# Altium project DriverControls.PrjPcb
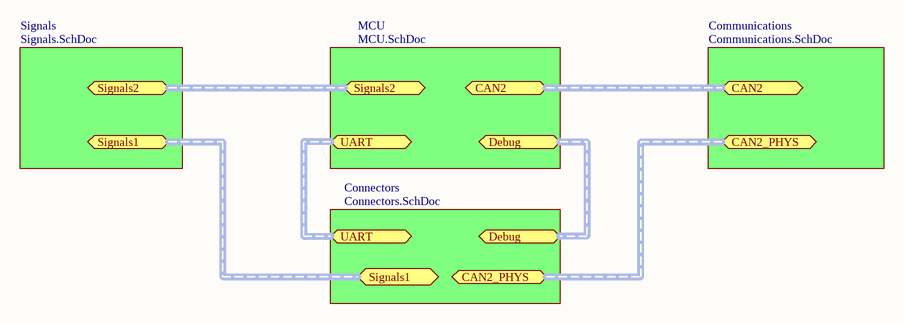
[diagram p0: Main.SchDoc]
7 sheets, 143 parts. Net scope: flat (ports and power ports of the same name join across sheets).
Board file: DriverControlsPCB.PcbDoc
Sheets:
  Main.SchDoc
    Connectors = Connectors.SchDoc
    MCU = MCU.SchDoc
    Communications = Communications.SchDoc
    Signals = Signals.SchDoc
  Connectors2.SchDoc
  Power.SchDoc

## Sheet Main.SchDoc
size A4

### Sub-sheets
Communications = Communications.SchDoc: no entries
Connectors = Connectors.SchDoc: no entries
MCU = MCU.SchDoc: no entries
Signals = Signals.SchDoc: no entries

### Ports
CAN2 (harness CAN), CAN2_PHYS (harness CAN_PHYS), Debug (harness Debug), Signals1 (harness Signals), Signals2 (harness Signals), UART (harness UART)

## Sheet Connectors.SchDoc
size A4
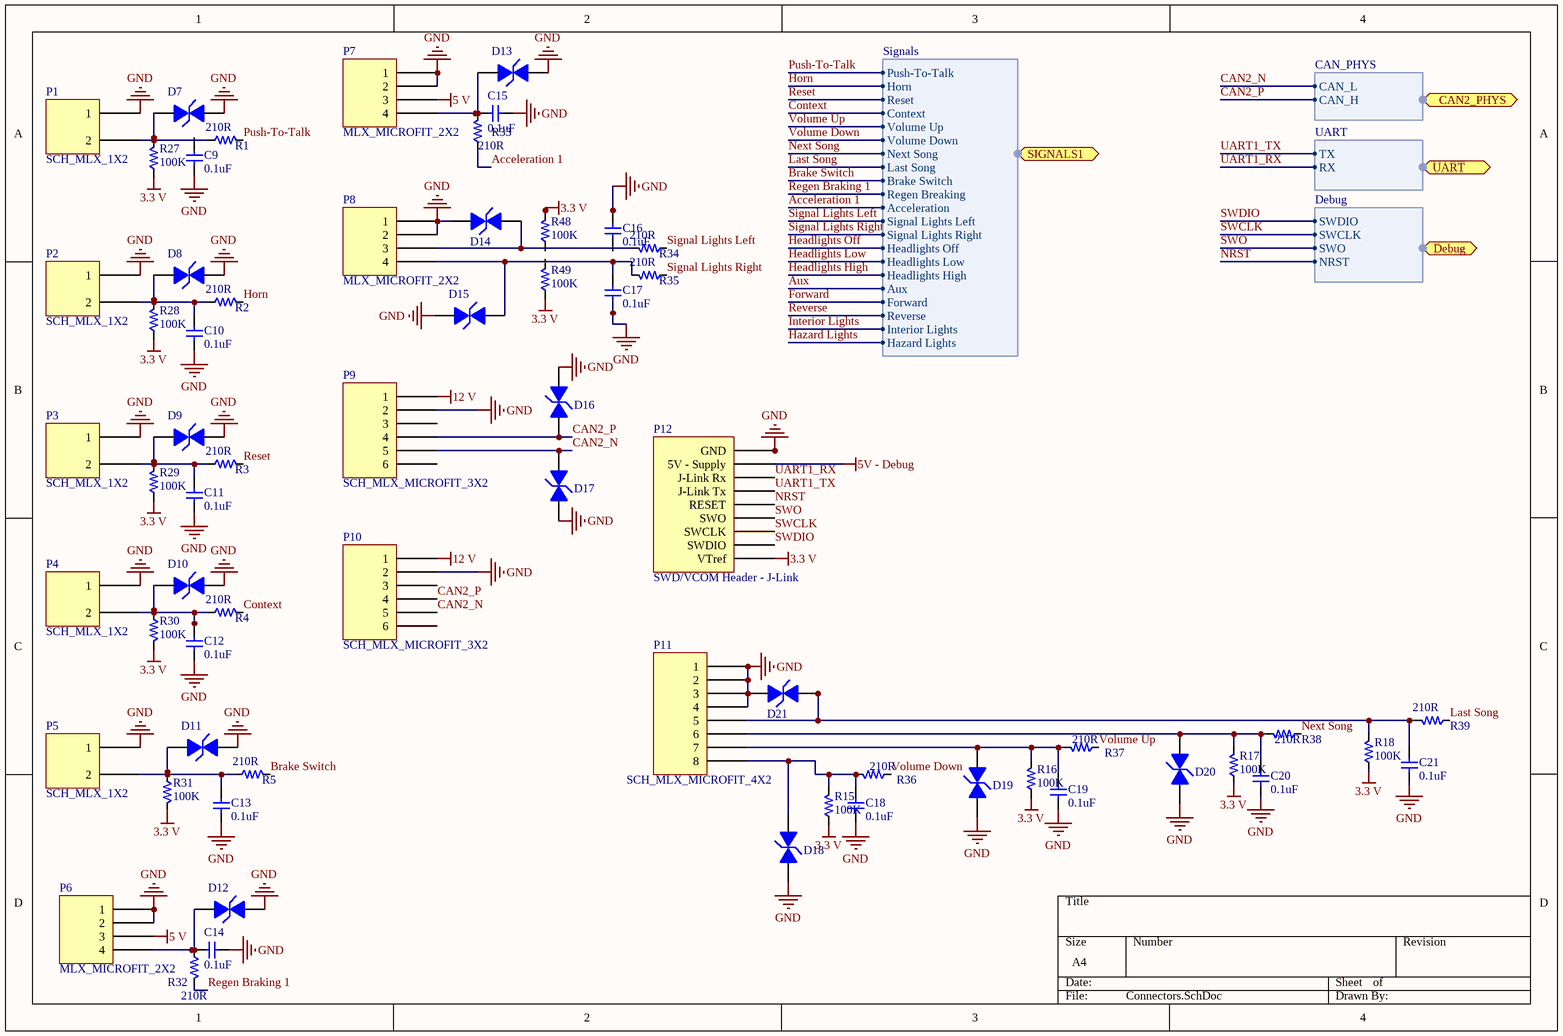
[diagram p1: Connectors.SchDoc]

### Parts
C9  value 0.1uF  [PCB_GENERIC_SMD_0603]  (hidden comment: C060-000U1-00)
C10  value 0.1uF  [PCB_GENERIC_SMD_0603]  (hidden comment: C060-000U1-00)
C11  value 0.1uF  [PCB_GENERIC_SMD_0603]  (hidden comment: C060-000U1-00)
C12  value 0.1uF  [PCB_GENERIC_SMD_0603]  (hidden comment: C060-000U1-00)
C13  value 0.1uF  [PCB_GENERIC_SMD_0603]  (hidden comment: C060-000U1-00)
C14  value 0.1uF  [PCB_GENERIC_SMD_0603]  (hidden comment: C060-000U1-00)
C15  value 0.1uF  [PCB_GENERIC_SMD_0603]  (hidden comment: C060-000U1-00)
C16  value 0.1uF  [PCB_GENERIC_SMD_0603]  (hidden comment: C060-000U1-00)
C17  value 0.1uF  [PCB_GENERIC_SMD_0603]  (hidden comment: C060-000U1-00)
C18  value 0.1uF  [PCB_GENERIC_SMD_0603]  (hidden comment: C060-000U1-00)
C19  value 0.1uF  [PCB_GENERIC_SMD_0603]  (hidden comment: C060-000U1-00)
C20  value 0.1uF  [PCB_GENERIC_SMD_0603]  (hidden comment: C060-000U1-00)
C21  value 0.1uF  [PCB_GENERIC_SMD_0603]  (hidden comment: C060-000U1-00)
D7  TVS Diode  [TVS Diode]  (value not drawn)
D8  TVS Diode  [TVS Diode]  (value not drawn)
D9  TVS Diode  [TVS Diode]  (value not drawn)
D10  TVS Diode  [TVS Diode]  (value not drawn)
D11  TVS Diode  [TVS Diode]  (value not drawn)
D12  TVS Diode  [TVS Diode]  (value not drawn)
D13  TVS Diode  [TVS Diode]  (value not drawn)
D14  TVS Diode  [TVS Diode]  (value not drawn)
D15  TVS Diode  [TVS Diode]  (value not drawn)
D16  TVS Diode  [TVS Diode]  (value not drawn)
D17  TVS Diode  [TVS Diode]  (value not drawn)
D18  TVS Diode  [TVS Diode]  (value not drawn)
D19  TVS Diode  [TVS Diode]  (value not drawn)
D20  TVS Diode  [TVS Diode]  (value not drawn)
D21  TVS Diode  [TVS Diode]  (value not drawn)
P1  SCH_MLX_1X2  [PCB_MLX_MICROFIT_1X2]
P2  SCH_MLX_1X2  [PCB_MLX_MICROFIT_1X2]
P3  SCH_MLX_1X2  [PCB_MLX_MICROFIT_1X2]
P4  SCH_MLX_1X2  [PCB_MLX_MICROFIT_1X2]
P5  SCH_MLX_1X2  [PCB_MLX_MICROFIT_1X2]
P6  MLX_MICROFIT_2X2  [MLX_MICROFIT_2X2]
P7  MLX_MICROFIT_2X2  [MLX_MICROFIT_2X2]
P8  MLX_MICROFIT_2X2  [MLX_MICROFIT_2X2]
P9  SCH_MLX_MICROFIT_3X2  [PCB_MLX_MICROFIT_3X2]
P10  SCH_MLX_MICROFIT_3X2  [PCB_MLX_MICROFIT_3X2]
P11  SCH_MLX_MICROFIT_4X2  [PCB_MLX_MICROFIT_4X2]
P12  SWD/VCOM Header - J-Link  [Samtec TST-110-01-G-D]
R1  Resistance: 210R  [PCB_GENERIC_SMD_0603]  (hidden comment: SCH_GENERIC_RESISTOR_0603)
R2  Resistance: 210R  [PCB_GENERIC_SMD_0603]  (hidden comment: SCH_GENERIC_RESISTOR_0603)
R3  Resistance: 210R  [PCB_GENERIC_SMD_0603]  (hidden comment: SCH_GENERIC_RESISTOR_0603)
R4  Resistance: 210R  [PCB_GENERIC_SMD_0603]  (hidden comment: SCH_GENERIC_RESISTOR_0603)
R5  Resistance: 210R  [PCB_GENERIC_SMD_0603]  (hidden comment: SCH_GENERIC_RESISTOR_0603)
R15  value 100K  [PCB_GENERIC_SMD_0603]  (hidden comment: R060-00104-05)
R16  value 100K  [PCB_GENERIC_SMD_0603]  (hidden comment: R060-00104-05)
R17  value 100K  [PCB_GENERIC_SMD_0603]  (hidden comment: R060-00104-05)
R18  value 100K  [PCB_GENERIC_SMD_0603]  (hidden comment: R060-00104-05)
R27  value 100K  [PCB_GENERIC_SMD_0603]  (hidden comment: R060-00104-05)
R28  value 100K  [PCB_GENERIC_SMD_0603]  (hidden comment: R060-00104-05)
R29  value 100K  [PCB_GENERIC_SMD_0603]  (hidden comment: R060-00104-05)
R30  value 100K  [PCB_GENERIC_SMD_0603]  (hidden comment: R060-00104-05)
R31  value 100K  [PCB_GENERIC_SMD_0603]  (hidden comment: R060-00104-05)
R32  Resistance: 210R  [PCB_GENERIC_SMD_0603]  (hidden comment: SCH_GENERIC_RESISTOR_0603)
R33  Resistance: 210R  [PCB_GENERIC_SMD_0603]  (hidden comment: SCH_GENERIC_RESISTOR_0603)
R34  Resistance: 210R  [PCB_GENERIC_SMD_0603]  (hidden comment: SCH_GENERIC_RESISTOR_0603)
R35  Resistance: 210R  [PCB_GENERIC_SMD_0603]  (hidden comment: SCH_GENERIC_RESISTOR_0603)
R36  Resistance: 210R  [PCB_GENERIC_SMD_0603]  (hidden comment: SCH_GENERIC_RESISTOR_0603)
R37  Resistance: 210R  [PCB_GENERIC_SMD_0603]  (hidden comment: SCH_GENERIC_RESISTOR_0603)
R38  Resistance: 210R  [PCB_GENERIC_SMD_0603]  (hidden comment: SCH_GENERIC_RESISTOR_0603)
R39  Resistance: 210R  [PCB_GENERIC_SMD_0603]  (hidden comment: SCH_GENERIC_RESISTOR_0603)
R48  value 100K  [PCB_GENERIC_SMD_0603]  (hidden comment: R060-00104-05)
R49  value 100K  [PCB_GENERIC_SMD_0603]  (hidden comment: R060-00104-05)

### Ports
CAN2_PHYS (harness CAN_PHYS), Debug (harness Debug), SIGNALS1 (harness Signals), UART (harness UART)

### Harnesses
Signals: Push-To-Talk, Horn, Reset, Context, Volume Up, Volume Down, Next Song, Last Song, Brake Switch, Regen Breaking, Acceleration, Signal Lights Left, Signal Lights Right, Headlights Off, Headlights Low, Headlights High, Aux, Forward, Reverse, Interior Lights, Hazard Lights
CAN_PHYS: CAN_L, CAN_H
UART: TX, RX
Debug: SWDIO, SWCLK, SWO, NRST

### Nets
3.3 V: P12.1(VTref) R17.1 R18.1 R48.2
5 V: P6.3 P7.3
5V - Debug: P12.19(5V_-_Supply)
12 V: P9.1 P10.1
GND: C16.1 C17.1 C20.1 C21.1 D7.1 D8.2 D9.2 D10.2 D11.2 D12.2 D13.2 D14.1 D15.1 D16.2 D17.1 D18.2 D19.2 D20.2 D21.1 P1.1 P2.1 P3.1 P4.1 P5.1 P6.1 P6.2 P7.1 P7.2 P8.1 P8.2 P9.2 P10.2 P11.1 P11.2 P11.3 P11.4 P12.4(GND) P12.6(GND) P12.8(GND) P12.10(GND) P12.12(GND)
Acceleration 1: R33.1 ; port SIGNALS1.Acceleration
Brake Switch: R5.2 ; port SIGNALS1.Brake Switch
CAN2_N: D17.2 P9.5 P10.5 ; port CAN2_PHYS.CAN_L
CAN2_P: D16.1 P9.4 P10.4 ; port CAN2_PHYS.CAN_H
Context: R4.2 ; port SIGNALS1.Context
Horn: R2.2 ; port SIGNALS1.Horn
Last Song: R39.1 ; port SIGNALS1.Last Song
Next Song: R38.1 ; port SIGNALS1.Next Song
NRST: P12.15(RESET) ; port Debug.NRST
Push-To-Talk: R1.2 ; port SIGNALS1.Push-To-Talk
Regen Braking 1: R32.2 ; port SIGNALS1.Regen Breaking
Reset: R3.2 ; port SIGNALS1.Reset
Signal Lights Left: R34.1 ; port SIGNALS1.Signal Lights Left
Signal Lights Right: R35.1 ; port SIGNALS1.Signal Lights Right
SWCLK: P12.9(SWCLK) ; port Debug.SWCLK
SWDIO: P12.7(SWDIO) ; port Debug.SWDIO
SWO: P12.13(SWO) ; port Debug.SWO
UART1_RX: P12.17(J-Link_Rx) ; port UART.RX
UART1_TX: P12.5(J-Link_Tx) ; port UART.TX
Volume Down: R36.1 ; port SIGNALS1.Volume Down
Volume Up: R37.1 ; port SIGNALS1.Volume Up
NetC10_2: C10.2 D8.1 P2.2 R2.1 R28.2
NetC11_2: C11.2 D9.1 P3.2 R3.1 R29.2
NetC12_1: C12.1 D10.1 P4.2 R4.1 R30.1
NetC13_1: C13.1 D11.1 P5.2 R5.1 R31.1
NetC14_1: C14.1 D12.1 P6.4 R32.1
NetC15_2: C15.2 D13.1 P7.4 R33.2
NetC17_2: C17.2 D15.2 P8.4 R35.2
NetC18_2: C18.2 D18.1 P11.8 R15.2 R36.2
NetC19_2: C19.2 D19.1 P11.7 R16.2 R37.2
NetC20_2: C20.2 D20.1 P11.6 R17.2 R38.2
NetC21_2: C21.2 D21.2 P11.5 R18.2 R39.2
NetD7_2: D7.2 P1.2 R1.1 R27.2
NetD14_2: D14.2 P8.3 R34.2

Not connected (* = marked no-connect by the designer): C9 1 2; C10 1; C11 1; C12 2; C13 2; C14 2; C15 1; C16 2; C18 1; C19 1; P9 3 6; P10 3 6; R15 1; R16 1; R27 1; R28 1; R29 1; R30 2; R31 2; R48 1; R49 1 2

### Notes on the sheet
- Labels drawn without touching a wire or pin: 3.3 V, GND

### Library data of the parts
C9-C21 = C060-000U1-00: CAP CER 0603 0.1uF 16V X5R 20%; Tolerance: 20%; Voltage: 16V; Package: 0603
D7-D21 = TVS Diode: Manufacturer: Bourns; Manufacturer ID: CDSOD323-T03SC
P11 = SCH_MLX_MICROFIT_4X2: Molex Microfit Connector 4x2
P12 = SWD/VCOM Header
R1-R5 R32-R39 = SCH_GENERIC_RESISTOR_0603: Generic SMD resistor 0603
R15-R18 R27-R31 R48 R49 = R060-00104-05: RES 0603 100K 5% 63mW; Tolerance: 5%; Power: 63mW; Package: 0603

## Sheet MCU.SchDoc
size A4
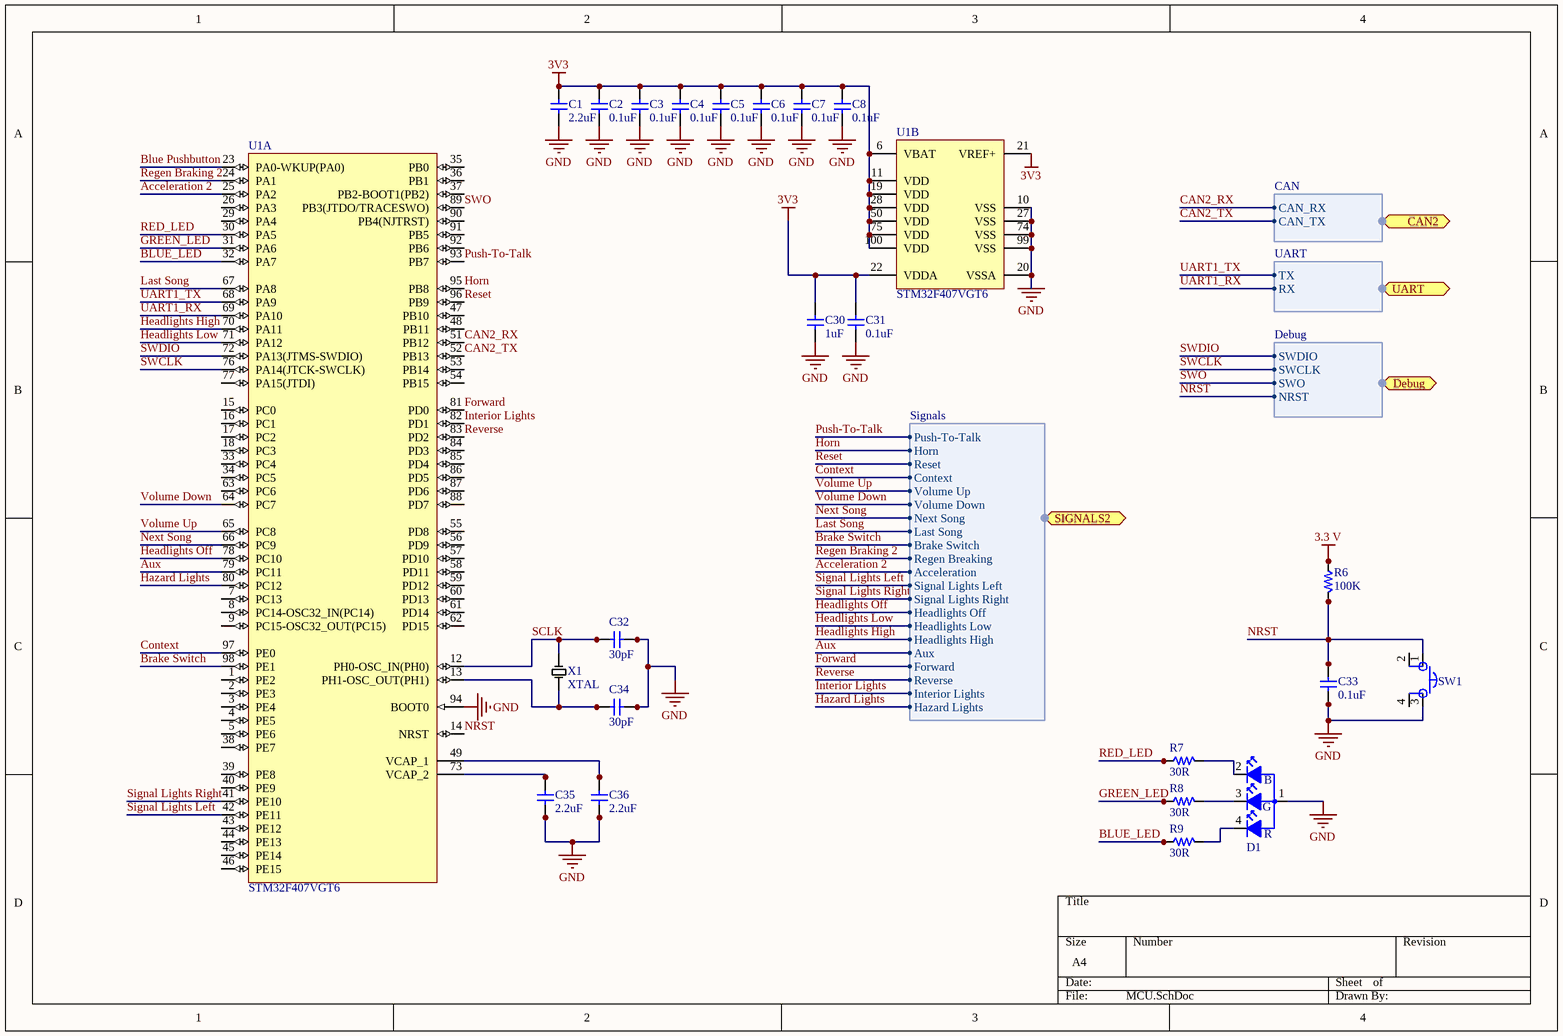
[diagram p2: MCU.SchDoc]

### Parts
C1  value 2.2uF  [PCB_GENERIC_SMD_0603]  (hidden comment: C060-002U2-00)
C2  value 0.1uF  [PCB_GENERIC_SMD_0603]  (hidden comment: C060-000U1-00)
C3  value 0.1uF  [PCB_GENERIC_SMD_0603]  (hidden comment: C060-000U1-00)
C4  value 0.1uF  [PCB_GENERIC_SMD_0603]  (hidden comment: C060-000U1-00)
C5  value 0.1uF  [PCB_GENERIC_SMD_0603]  (hidden comment: C060-000U1-00)
C6  value 0.1uF  [PCB_GENERIC_SMD_0603]  (hidden comment: C060-000U1-00)
C7  value 0.1uF  [PCB_GENERIC_SMD_0603]  (hidden comment: C060-000U1-00)
C8  value 0.1uF  [PCB_GENERIC_SMD_0603]  (hidden comment: C060-000U1-00)
C30  value 1uF  [PCB_GENERIC_SMD_0603]  (hidden comment: C060-0001U-00)
C31  value 0.1uF  [PCB_GENERIC_SMD_0603]  (hidden comment: C060-000U1-00)
C32  value 30pF  [PCB_GENERIC_SMD_0603]  (hidden comment: C060-0030P-00)
C33  value 0.1uF  [PCB_GENERIC_SMD_0603]  (hidden comment: C060-000U1-00)
C34  value 30pF  [PCB_GENERIC_SMD_0603]  (hidden comment: C060-0030P-00)
C35  value 2.2uF  [PCB_GENERIC_SMD_0603]  (hidden comment: C060-002U2-00)
C36  value 2.2uF  [PCB_GENERIC_SMD_0603]  (hidden comment: C060-002U2-00)
D1  D0S4-000CR-00  [CLMVB-FKA]  (value not drawn)
R6  value 100K  [PCB_GENERIC_SMD_0603]  (hidden comment: R060-00104-05)
R7  value 30R  [PCB_GENERIC_SMD_0603]  (hidden comment: R060-00300-05)
R8  value 30R  [PCB_GENERIC_SMD_0603]  (hidden comment: R060-00300-05)
R9  value 30R  [PCB_GENERIC_SMD_0603]  (hidden comment: R060-00300-05)
SW1  Tactile Switch  [C&K 4 pin Tactile Switch]  (value not drawn)
U1  STM32F407VGT6  [STM-LQFP100_M]  (parts A,B of 2)
X1  XTAL  [CRYSTAL_8MHZ]

### Ports
CAN2 (harness CAN), Debug (harness Debug), SIGNALS2 (harness Signals), UART (harness UART)

### Harnesses
Debug: SWDIO, SWCLK, SWO, NRST
CAN: CAN_RX, CAN_TX
UART: TX, RX
Signals: Push-To-Talk, Horn, Reset, Context, Volume Up, Volume Down, Next Song, Last Song, Brake Switch, Regen Breaking, Acceleration, Signal Lights Left, Signal Lights Right, Headlights Off, Headlights Low, Headlights High, Aux, Forward, Reverse, Interior Lights, Hazard Lights

### Nets
3.3 V: R6.1
3V3: C1.2 C2.2 C3.2 C4.2 C5.2 C6.2 C7.2 C8.2 C30.2 C31.2 U1.6(VBAT) U1.11(VDD) U1.19(VDD) U1.21(VREF+) U1.22(VDDA) U1.28(VDD) U1.50(VDD) U1.75(VDD) U1.100(VDD)
GND: C1.1 C2.1 C3.1 C4.1 C5.1 C6.1 C7.1 C8.1 C30.1 C31.1 C32.1 C33.2 C34.1 C35.1 C36.1 D1.1(Red) SW1.3 U1.10(VSS) U1.20(VSSA) U1.27(VSS) U1.74(VSS) U1.94(BOOT0) U1.99(VSS)
Acceleration 2: U1.25(PA2) ; port SIGNALS2.Acceleration
Aux: U1.79(PC11) ; port SIGNALS2.Aux
Blue Pushbutton: U1.23(PA0-WKUP(PA0))
BLUE_LED: R9.1 U1.32(PA7)
Brake Switch: U1.98(PE1) ; port SIGNALS2.Brake Switch
CAN2_RX: U1.51(PB12) ; port CAN2.CAN_RX
CAN2_TX: U1.52(PB13) ; port CAN2.CAN_TX
Context: U1.97(PE0) ; port SIGNALS2.Context
Forward: U1.81(PD0) ; port SIGNALS2.Forward
GREEN_LED: R8.1 U1.31(PA6)
Hazard Lights: U1.80(PC12) ; port SIGNALS2.Hazard Lights
Headlights High: U1.70(PA11) ; port SIGNALS2.Headlights High
Headlights Low: U1.71(PA12) ; port SIGNALS2.Headlights Low
Headlights Off: U1.78(PC10) ; port SIGNALS2.Headlights Off
Horn: U1.95(PB8) ; port SIGNALS2.Horn
Interior Lights: U1.82(PD1) ; port SIGNALS2.Interior Lights
Last Song: U1.67(PA8) ; port SIGNALS2.Last Song
Next Song: U1.66(PC9) ; port SIGNALS2.Next Song
NRST: C33.1 R6.2 SW1.1 U1.14(NRST) ; port Debug.NRST
Push-To-Talk: U1.93(PB7) ; port SIGNALS2.Push-To-Talk
RED_LED: R7.1 U1.30(PA5)
Regen Braking 2: U1.24(PA1) ; port SIGNALS2.Regen Breaking
Reset: U1.96(PB9) ; port SIGNALS2.Reset
Reverse: U1.83(PD2) ; port SIGNALS2.Reverse
SCLK: C32.2 U1.12(PH0-OSC_IN(PH0)) X1.1
Signal Lights Left: U1.42(PE11) ; port SIGNALS2.Signal Lights Left
Signal Lights Right: U1.41(PE10) ; port SIGNALS2.Signal Lights Right
SWCLK: U1.76(PA14(JTCK-SWCLK)) ; port Debug.SWCLK
SWDIO: U1.72(PA13(JTMS-SWDIO)) ; port Debug.SWDIO
SWO: U1.89(PB3(JTDO/TRACESWO)) ; port Debug.SWO
UART1_RX: U1.69(PA10) ; port UART.RX
UART1_TX: U1.68(PA9) ; port UART.TX
Volume Down: U1.64(PC7) ; port SIGNALS2.Volume Down
Volume Up: U1.65(PC8) ; port SIGNALS2.Volume Up
NetC34_2: C34.2 U1.13(PH1-OSC_OUT(PH1)) X1.2
NetC35_2: C35.2 U1.73(VCAP_2)
NetC36_2: C36.2 U1.49(VCAP_1)
NetD1_2: D1.2(Green) R7.2
NetD1_3: D1.3(Blue) R8.2
NetD1_4: D1.4 R9.2

Not connected (* = marked no-connect by the designer): SW1 2 4; U1 1(PE2) 2(PE3) 3(PE4) 4(PE5) 5(PE6) 7(PC13) 8(PC14-OSC32_IN(PC14)) 9(PC15-OSC32_OUT(PC15)) 15(PC0) 16(PC1) 17(PC2) 18(PC3) 26(PA3) 29(PA4) 33(PC4) 34(PC5) 35(PB0) 36(PB1) 37(PB2-BOOT1(PB2)) 38(PE7) 39(PE8) 40(PE9) 43(PE12) 44(PE13) 45(PE14) 46(PE15) 47(PB10) 48(PB11) 53(PB14) 54(PB15) 55(PD8) 56(PD9) 57(PD10) 58(PD11) 59(PD12) 60(PD13) 61(PD14) 62(PD15) 63(PC6) 77(PA15(JTDI)) 84(PD3) 85(PD4) 86(PD5) 87(PD6) 88(PD7) 90(PB4(NJTRST)) 91(PB5) 92(PB6)

### Notes on the sheet
- (in symbol D0S4-000CR-00) B; G; R

### Library data of the parts
C1 C35 C36 = C060-002U2-00: CAP CER 0603 2.2uF 16V X5R 20%; Tolerance: 20%; Voltage: 16V; Package: 0603
C2-C8 C31 C33 = C060-000U1-00: CAP CER 0603 0.1uF 16V X5R 20%; Tolerance: 20%; Voltage: 16V; Package: 0603
C30 = C060-0001U-00: CAP CER 0603 1uF 16V X5R 20%; Tolerance: 20%; Voltage: 16V; Package: 0603
C32 C34 = C060-0030P-00: CAP CER 0603 30pF 50V NP0 5%; Tolerance: 5%; Voltage: 50V; Package: 0603
D1 = D0S4-000CR-00: LED 4SMD RGB 2Vf 3Vf 3Vf 20mA 10mA 10mA; Supplier 1: Digi-Key; Supplier Part Number 1: CLMVB-FKA-CFHEHLCBB7A363CT-ND; Color: RGB
R6 = R060-00104-05: RES 0603 100K 5% 63mW; Tolerance: 5%; Power: 63mW; Package: 0603
R7-R9 = R060-00300-05: RES 0603 30ohm 5% 100mW; Tolerance: 5%; Power: 100mW; Package: 0603
SW1 = C&K Tactile Switch: Supplier 1: Digi-Key; Supplier Part Number 1: CKN9085CT-ND
U1 = STM32F407VGT6: ARM Cortex-M4 32-bit MCU+FPU, 210 DMIPS, 1024 kB Flash, 192 kB Internal RAM, 82 I/Os, 100-pin LQFP, -40 to 85 degC, Tray; Manufacturer: STMicroelectronics; D/A Converter: 2x12-bit; FLASH Size (Prog) (kB): 1024; I/Os (High Current): 82; Internal RAM Size (kB): 192; Operating Frequency(F) (Processor speed) (MHz): 168; Supply Voltage(Vcc) max (V): 3.6; Supply Voltage(Vcc) min (V): 1.8; DatasheetVersion: Rev. 4; PackageVersion: Rev. 1, 06/2013; PackageReference: LQFP100; PackageDescription: 100-Pin Low Profile Quad Flat Package, 14 x 14 mm Body, 0.5 mm Pitch; Supplier 1: Digi-Key; Supplier Part Number 1: 497-11605-ND; Supplier 2: Farnell; Supplier Part Number 2: 2064368; Supplier 3: Newark; Supplier Part Number 3: 73T2333; Supplier 4: Mouser; Supplier Part Number 4: 511-STM32F407VGT6; Core: ARM Cortex-M4; Packing: Tray; Mounting Technology: Surface Mount; PartNumber: STM32F407VGT6; ComponentLink1Description: Manufacturer URL; ComponentLink1URL: http://www.st.com/web/en/home.html; ComponentLink2Description: Datasheet; ComponentLink2URL: http://www.st.com/st-web-ui/static/active/en/resource/technical/document/datasheet/DM00037051.pdf; ComponentLink3Description: Package Specification; ComponentLink3URL: http://www.st.com/st-web-ui/static/active/en/resource/technical/document/data_brief/DM00071938.pdf
X1 = Crystal: Frequency: 8MHz

## Sheet Communications.SchDoc
size A4
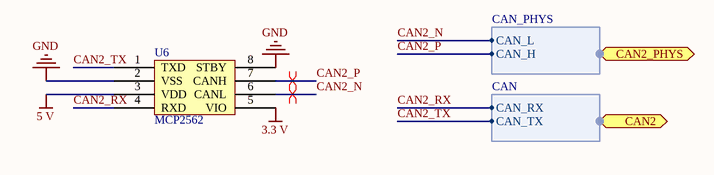
[diagram p3: Communications.SchDoc]

### Parts
U6  MCP2562  [MCP2562]

### Ports
CAN2 (harness CAN), CAN2_PHYS (harness CAN_PHYS)

### Harnesses
CAN_PHYS: CAN_L, CAN_H
CAN: CAN_RX, CAN_TX

### Nets
3.3 V: U6.5(VIO)
5 V: U6.3(VDD)
GND: U6.2(VSS) U6.8(STBY)
CAN2_N: U6.6(CANL) ; port CAN2_PHYS.CAN_L
CAN2_P: U6.7(CANH) ; port CAN2_PHYS.CAN_H
CAN2_RX: U6.4(RXD) ; port CAN2.CAN_RX
CAN2_TX: U6.1(TXD) ; port CAN2.CAN_TX

### Layout directives
differential pair: CAN2_N, CAN2_P

## Sheet Signals.SchDoc
size A4
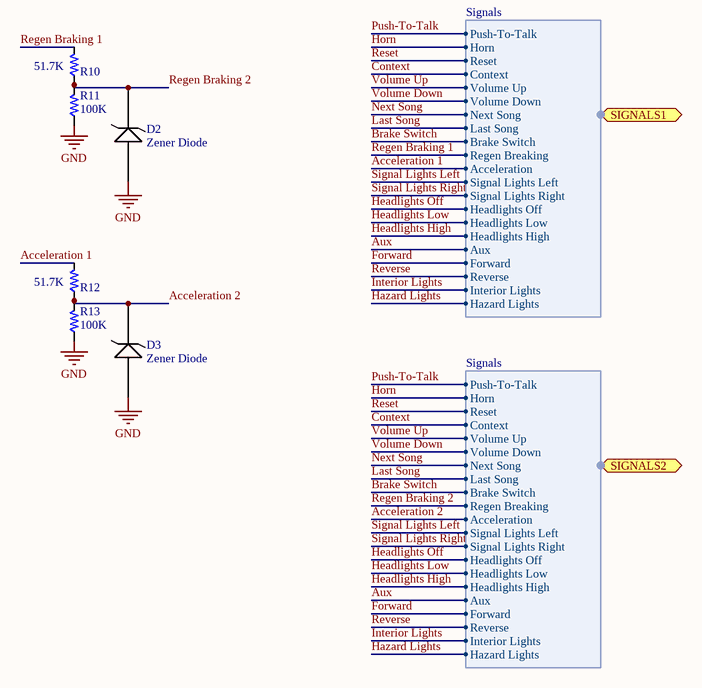
[diagram p4: Signals.SchDoc]

### Parts
D2  Zener Diode  [PCBComponent_1]
D3  Zener Diode  [PCBComponent_1]
R10  Resistance: 51.7K  [PCB_GENERIC_SMD_0603]  (hidden comment: SCH_GENERIC_RESISTOR_0603)
R11  value 100K  [PCB_GENERIC_SMD_0603]  (hidden comment: R060-00104-05)
R12  Resistance: 51.7K  [PCB_GENERIC_SMD_0603]  (hidden comment: SCH_GENERIC_RESISTOR_0603)
R13  value 100K  [PCB_GENERIC_SMD_0603]  (hidden comment: R060-00104-05)

### Ports
SIGNALS1 (harness Signals), SIGNALS2 (harness Signals)

### Harnesses
Signals: Push-To-Talk, Horn, Reset, Context, Volume Up, Volume Down, Next Song, Last Song, Brake Switch, Regen Breaking, Acceleration, Signal Lights Left, Signal Lights Right, Headlights Off, Headlights Low, Headlights High, Aux, Forward, Reverse, Interior Lights, Hazard Lights

### Nets
GND: D2.2 D3.2
Acceleration 1: R12.2 ; port SIGNALS1.Acceleration
Acceleration 2: D3.1 R12.1 R13.2 ; port SIGNALS2.Acceleration
Aux: port SIGNALS1.Aux, port SIGNALS2.Aux
Brake Switch: port SIGNALS1.Brake Switch, port SIGNALS2.Brake Switch
Context: port SIGNALS1.Context, port SIGNALS2.Context
Forward: port SIGNALS1.Forward, port SIGNALS2.Forward
Hazard Lights: port SIGNALS1.Hazard Lights, port SIGNALS2.Hazard Lights
Headlights High: port SIGNALS1.Headlights High, port SIGNALS2.Headlights High
Headlights Low: port SIGNALS1.Headlights Low, port SIGNALS2.Headlights Low
Headlights Off: port SIGNALS1.Headlights Off, port SIGNALS2.Headlights Off
Horn: port SIGNALS1.Horn, port SIGNALS2.Horn
Interior Lights: port SIGNALS1.Interior Lights, port SIGNALS2.Interior Lights
Last Song: port SIGNALS1.Last Song, port SIGNALS2.Last Song
Next Song: port SIGNALS1.Next Song, port SIGNALS2.Next Song
Push-To-Talk: port SIGNALS1.Push-To-Talk, port SIGNALS2.Push-To-Talk
Regen Braking 1: R10.2 ; port SIGNALS1.Regen Breaking
Regen Braking 2: D2.1 R10.1 R11.2 ; port SIGNALS2.Regen Breaking
Reset: port SIGNALS1.Reset, port SIGNALS2.Reset
Reverse: port SIGNALS1.Reverse, port SIGNALS2.Reverse
Signal Lights Left: port SIGNALS1.Signal Lights Left, port SIGNALS2.Signal Lights Left
Signal Lights Right: port SIGNALS1.Signal Lights Right, port SIGNALS2.Signal Lights Right
Volume Down: port SIGNALS1.Volume Down, port SIGNALS2.Volume Down
Volume Up: port SIGNALS1.Volume Up, port SIGNALS2.Volume Up

Not connected (* = marked no-connect by the designer): R11 1; R13 1

### Notes on the sheet
- Labels drawn without touching a wire or pin: GND

### Library data of the parts
D2 D3 = ON Semi Schottky Diode - MBRM110LT1G
R10 R12 = SCH_GENERIC_RESISTOR_0603: Generic SMD resistor 0603
R11 R13 = R060-00104-05: RES 0603 100K 5% 63mW; Tolerance: 5%; Power: 63mW; Package: 0603

## Sheet Connectors2.SchDoc
size A4
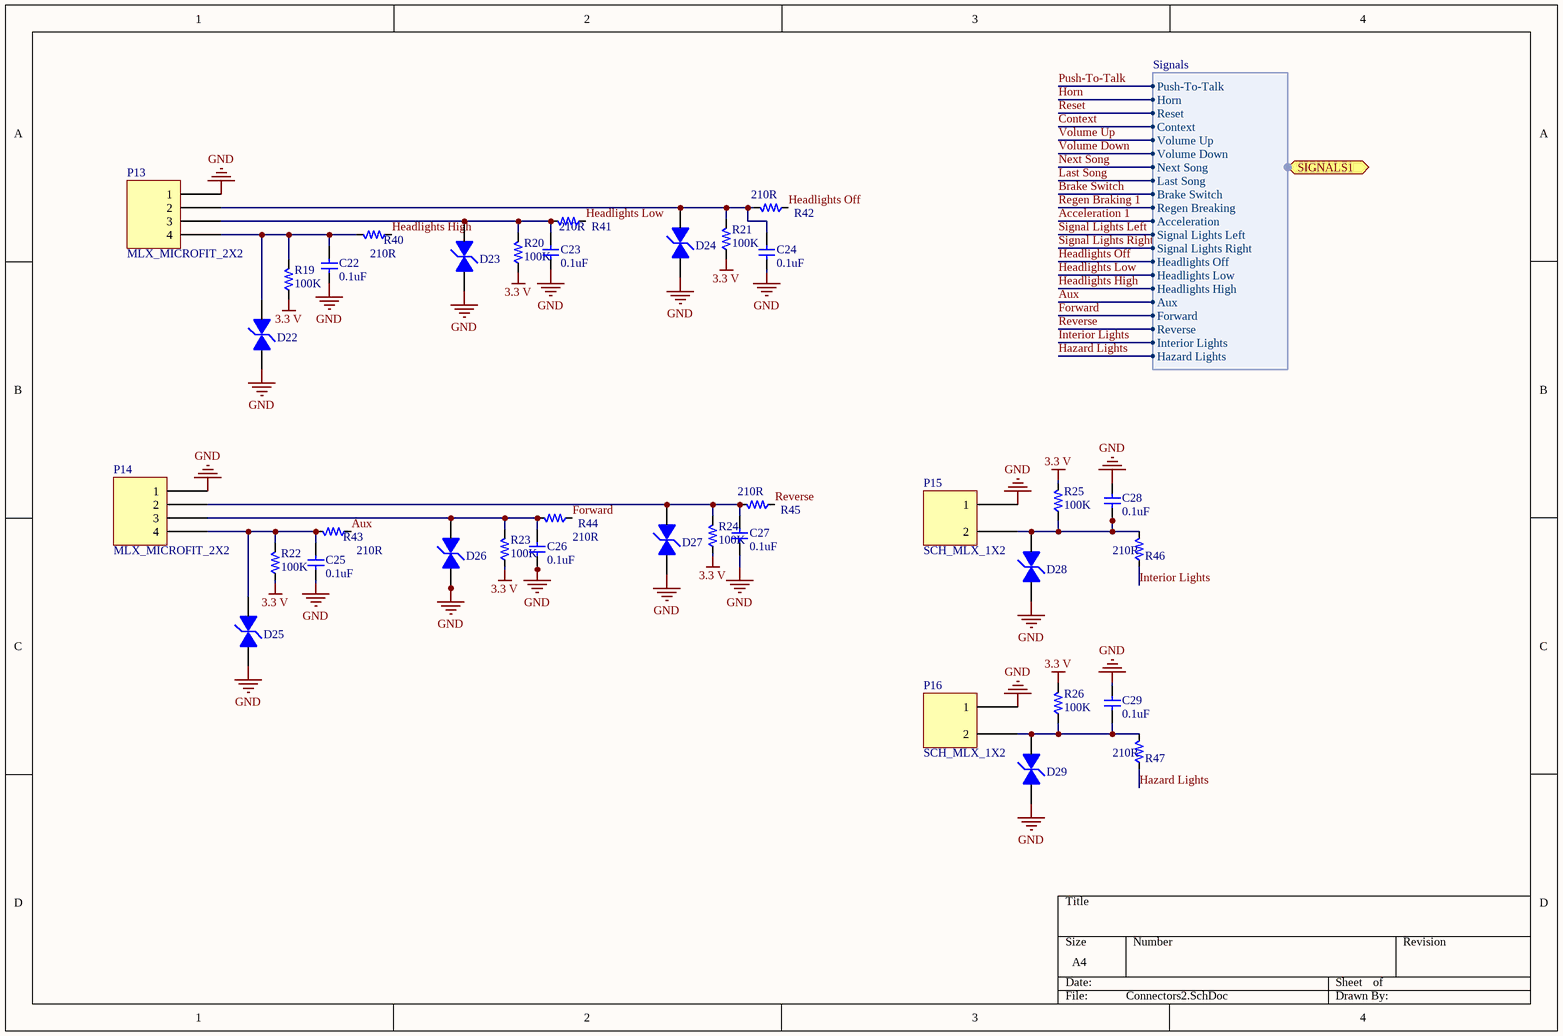
[diagram p5: Connectors2.SchDoc]

### Parts
C22  value 0.1uF  [PCB_GENERIC_SMD_0603]  (hidden comment: C060-000U1-00)
C23  value 0.1uF  [PCB_GENERIC_SMD_0603]  (hidden comment: C060-000U1-00)
C24  value 0.1uF  [PCB_GENERIC_SMD_0603]  (hidden comment: C060-000U1-00)
C25  value 0.1uF  [PCB_GENERIC_SMD_0603]  (hidden comment: C060-000U1-00)
C26  value 0.1uF  [PCB_GENERIC_SMD_0603]  (hidden comment: C060-000U1-00)
C27  value 0.1uF  [PCB_GENERIC_SMD_0603]  (hidden comment: C060-000U1-00)
C28  value 0.1uF  [PCB_GENERIC_SMD_0603]  (hidden comment: C060-000U1-00)
C29  value 0.1uF  [PCB_GENERIC_SMD_0603]  (hidden comment: C060-000U1-00)
D22  TVS Diode  [TVS Diode]  (value not drawn)
D23  TVS Diode  [TVS Diode]  (value not drawn)
D24  TVS Diode  [TVS Diode]  (value not drawn)
D25  TVS Diode  [TVS Diode]  (value not drawn)
D26  TVS Diode  [TVS Diode]  (value not drawn)
D27  TVS Diode  [TVS Diode]  (value not drawn)
D28  TVS Diode  [TVS Diode]  (value not drawn)
D29  TVS Diode  [TVS Diode]  (value not drawn)
P13  MLX_MICROFIT_2X2  [MLX_MICROFIT_2X2]
P14  MLX_MICROFIT_2X2  [MLX_MICROFIT_2X2]
P15  SCH_MLX_1X2  [PCB_MLX_MICROFIT_1X2]
P16  SCH_MLX_1X2  [PCB_MLX_MICROFIT_1X2]
R19  value 100K  [PCB_GENERIC_SMD_0603]  (hidden comment: R060-00104-05)
R20  value 100K  [PCB_GENERIC_SMD_0603]  (hidden comment: R060-00104-05)
R21  value 100K  [PCB_GENERIC_SMD_0603]  (hidden comment: R060-00104-05)
R22  value 100K  [PCB_GENERIC_SMD_0603]  (hidden comment: R060-00104-05)
R23  value 100K  [PCB_GENERIC_SMD_0603]  (hidden comment: R060-00104-05)
R24  value 100K  [PCB_GENERIC_SMD_0603]  (hidden comment: R060-00104-05)
R25  value 100K  [PCB_GENERIC_SMD_0603]  (hidden comment: R060-00104-05)
R26  value 100K  [PCB_GENERIC_SMD_0603]  (hidden comment: R060-00104-05)
R40  Resistance: 210R  [PCB_GENERIC_SMD_0603]  (hidden comment: SCH_GENERIC_RESISTOR_0603)
R41  Resistance: 210R  [PCB_GENERIC_SMD_0603]  (hidden comment: SCH_GENERIC_RESISTOR_0603)
R42  Resistance: 210R  [PCB_GENERIC_SMD_0603]  (hidden comment: SCH_GENERIC_RESISTOR_0603)
R43  Resistance: 210R  [PCB_GENERIC_SMD_0603]  (hidden comment: SCH_GENERIC_RESISTOR_0603)
R44  Resistance: 210R  [PCB_GENERIC_SMD_0603]  (hidden comment: SCH_GENERIC_RESISTOR_0603)
R45  Resistance: 210R  [PCB_GENERIC_SMD_0603]  (hidden comment: SCH_GENERIC_RESISTOR_0603)
R46  Resistance: 210R  [PCB_GENERIC_SMD_0603]  (hidden comment: SCH_GENERIC_RESISTOR_0603)
R47  Resistance: 210R  [PCB_GENERIC_SMD_0603]  (hidden comment: SCH_GENERIC_RESISTOR_0603)

### Ports
SIGNALS1 (harness Signals)

### Harnesses
Signals: Push-To-Talk, Horn, Reset, Context, Volume Up, Volume Down, Next Song, Last Song, Brake Switch, Regen Breaking, Acceleration, Signal Lights Left, Signal Lights Right, Headlights Off, Headlights Low, Headlights High, Aux, Forward, Reverse, Interior Lights, Hazard Lights

### Nets
3.3 V: R22.1 R23.1 R24.1 R25.2
GND: C24.1 C25.1 C26.1 C27.1 C29.2 D22.2 D23.2 D24.2 D25.2 D26.2 D27.2 D28.2 D29.2 P13.1 P14.1 P15.1 P16.1
Aux: R43.1 ; port SIGNALS1.Aux
Forward: R44.1 ; port SIGNALS1.Forward
Hazard Lights: R47.1 ; port SIGNALS1.Hazard Lights
Headlights High: R40.1 ; port SIGNALS1.Headlights High
Headlights Low: R41.1 ; port SIGNALS1.Headlights Low
Headlights Off: R42.1 ; port SIGNALS1.Headlights Off
Interior Lights: R46.1 ; port SIGNALS1.Interior Lights
Reverse: R45.1 ; port SIGNALS1.Reverse
NetC22_2: C22.2 D22.1 P13.4 R19.2 R40.2
NetC23_2: C23.2 D23.1 P13.3 R20.2 R41.2
NetC24_2: C24.2 D24.1 P13.2 R21.2 R42.2
NetC25_2: C25.2 D25.1 P14.4 R22.2 R43.2
NetC26_2: C26.2 D26.1 P14.3 R23.2 R44.2
NetC27_2: C27.2 D27.1 P14.2 R24.2 R45.2
NetC28_1: C28.1 D28.1 P15.2 R25.1 R46.2
NetC29_1: C29.1 D29.1 P16.2 R26.1 R47.2

Not connected (* = marked no-connect by the designer): C22 1; C23 1; C28 2; R19 1; R20 1; R21 1; R26 2

### Notes on the sheet
- Labels drawn without touching a wire or pin: 3.3 V, GND

### Library data of the parts
C22-C29 = C060-000U1-00: CAP CER 0603 0.1uF 16V X5R 20%; Tolerance: 20%; Voltage: 16V; Package: 0603
D22-D29 = TVS Diode: as D7 on sheet Connectors
R19-R26 = R060-00104-05: RES 0603 100K 5% 63mW; Tolerance: 5%; Power: 63mW; Package: 0603
R40-R47 = SCH_GENERIC_RESISTOR_0603: Generic SMD resistor 0603

## Sheet Power.SchDoc
size A4
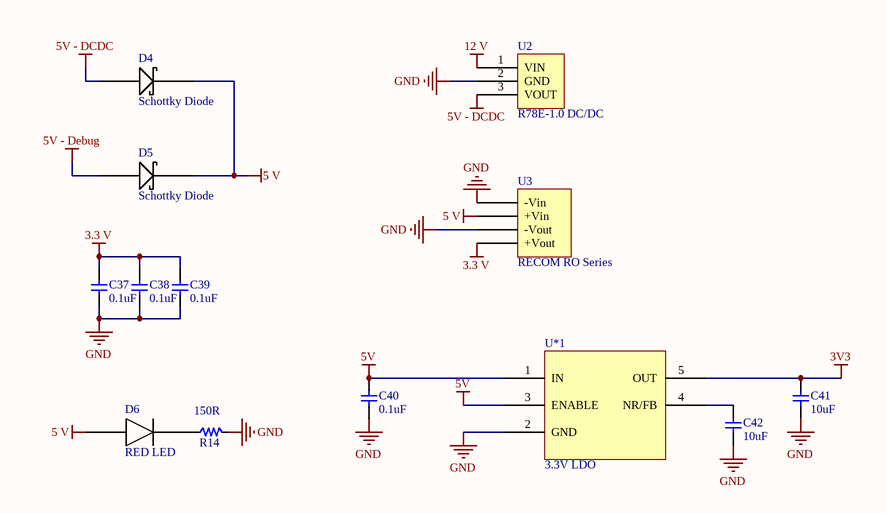
[diagram p6: Power.SchDoc]

### Parts
C37  value 0.1uF  [PCB_GENERIC_SMD_0603]  (hidden comment: C060-000U1-00)
C38  value 0.1uF  [PCB_GENERIC_SMD_0603]  (hidden comment: C060-000U1-00)
C39  value 0.1uF  [PCB_GENERIC_SMD_0603]  (hidden comment: C060-000U1-00)
C40  value 0.1uF  [PCB_GENERIC_SMD_0603]  (hidden comment: C060-000U1-00)
C41  value 10uF  [PCB_GENERIC_SMD_0603]  (hidden comment: C060-0010U-00)
C42  value 10uF  [PCB_GENERIC_SMD_0603]  (hidden comment: C060-0010U-00)
D4  Schottky Diode  [ON Semi Schottky Diode - MBRM110LT1G]
D5  Schottky Diode  [ON Semi Schottky Diode - MBRM110LT1G]
D6  RED LED  [SMD_0603_LED]
R14  SCH_GENERIC_RESISTOR_0603  [PCB_GENERIC_SMD_0603]  (value not drawn)
U2  R78E-1.0 DC/DC  [R78-1.0]
U3  RECOM RO Series  [RECOM RO Series 1W DCDC]
U*1  3.3V LDO  [SOT95P280X145-5N]

### Nets
3.3 V: C37.2 C38.2 C39.2 U3.4(+Vout)
3V3: C41.2 U*1.5(OUT)
5 V: D4.1 D5.1 D6.1 U3.2(+Vin)
5V: C40.2 U*1.1(IN) U*1.3(ENABLE)
5V - DCDC: D4.2 U2.3(VOUT)
5V - Debug: D5.2
12 V: U2.1(VIN)
GND: C37.1 C38.1 C39.1 C40.1 C41.1 C42.1 R14.2 U2.2(GND) U3.1(-Vin) U3.3(-Vout) U*1.2(GND)
NetC42_2: C42.2 U*1.4(NR/FB)
NetD6_2: D6.2 R14.1

### Notes on the sheet
- (near R14) 150R

### Library data of the parts
C37-C40 = C060-000U1-00: CAP CER 0603 0.1uF 16V X5R 20%; Tolerance: 20%; Voltage: 16V; Package: 0603
C41 C42 = C060-0010U-00: CAP CER 0603 10uF 6.3V X5R 20%; Tolerance: 20%; Voltage: 6.3V; Package: 0603
D4 D5 = ON Semi Schottky Diode - MBRM110LT1G
D6 = SMD_0603_LED
R14 = SCH_GENERIC_RESISTOR_0603: Generic SMD resistor 0603; Resistance: *
U2 = R78E-1.0
U3 = RECOM RO Series DCDC Converter
U*1 = 3V3LDO_TPS73633DBVR_SOT23-5: Linear Voltage Regulator IC Positive Fixed 1 Output 3.3V 400mA SOT-23-5

## Nets that join several sheets
3.3 V: Connectors (P12.1 R17.1 R18.1 R48.2), MCU (R6.1), Communications (U6.5), Connectors2 (R22.1 R23.1 R24.1 R25.2), Power (C37.2 C38.2 C39.2 U3.4)
3V3: MCU (19 pins), Power (C41.2 U*1.5)
5 V: Connectors (P6.3 P7.3), Communications (U6.3), Power (D4.1 D5.1 D6.1 U3.2)
5V - Debug: Connectors (P12.19), Power (D5.2)
12 V: Connectors (P9.1 P10.1), Power (U2.1)
GND: Connectors (41 pins), MCU (23 pins), Communications (U6.2 U6.8), Signals (D2.2 D3.2), Connectors2 (17 pins), Power (11 pins)
Acceleration 1: Connectors (R33.1), Signals (R12.2)
Acceleration 2: MCU (U1.25), Signals (D3.1 R12.1 R13.2)
Aux: MCU (U1.79), Connectors2 (R43.1)
Brake Switch: Connectors (R5.2), MCU (U1.98)
CAN2_N: Connectors (D17.2 P9.5 P10.5), Communications (U6.6)
CAN2_P: Connectors (D16.1 P9.4 P10.4), Communications (U6.7)
CAN2_RX: MCU (U1.51), Communications (U6.4)
CAN2_TX: MCU (U1.52), Communications (U6.1)
Context: Connectors (R4.2), MCU (U1.97)
Forward: MCU (U1.81), Connectors2 (R44.1)
Hazard Lights: MCU (U1.80), Connectors2 (R47.1)
Headlights High: MCU (U1.70), Connectors2 (R40.1)
Headlights Low: MCU (U1.71), Connectors2 (R41.1)
Headlights Off: MCU (U1.78), Connectors2 (R42.1)
Horn: Connectors (R2.2), MCU (U1.95)
Interior Lights: MCU (U1.82), Connectors2 (R46.1)
Last Song: Connectors (R39.1), MCU (U1.67)
Next Song: Connectors (R38.1), MCU (U1.66)
NRST: Connectors (P12.15), MCU (C33.1 R6.2 SW1.1 U1.14)
Push-To-Talk: Connectors (R1.2), MCU (U1.93)
Regen Braking 1: Connectors (R32.2), Signals (R10.2)
Regen Braking 2: MCU (U1.24), Signals (D2.1 R10.1 R11.2)
Reset: Connectors (R3.2), MCU (U1.96)
Reverse: MCU (U1.83), Connectors2 (R45.1)
Signal Lights Left: Connectors (R34.1), MCU (U1.42)
Signal Lights Right: Connectors (R35.1), MCU (U1.41)
SWCLK: Connectors (P12.9), MCU (U1.76)
SWDIO: Connectors (P12.7), MCU (U1.72)
SWO: Connectors (P12.13), MCU (U1.89)
UART1_RX: Connectors (P12.17), MCU (U1.69)
UART1_TX: Connectors (P12.5), MCU (U1.68)
Volume Down: Connectors (R36.1), MCU (U1.64)
Volume Up: Connectors (R37.1), MCU (U1.65)